# EAGLE design wireless-probe-v1 (EAGLE 6.4)
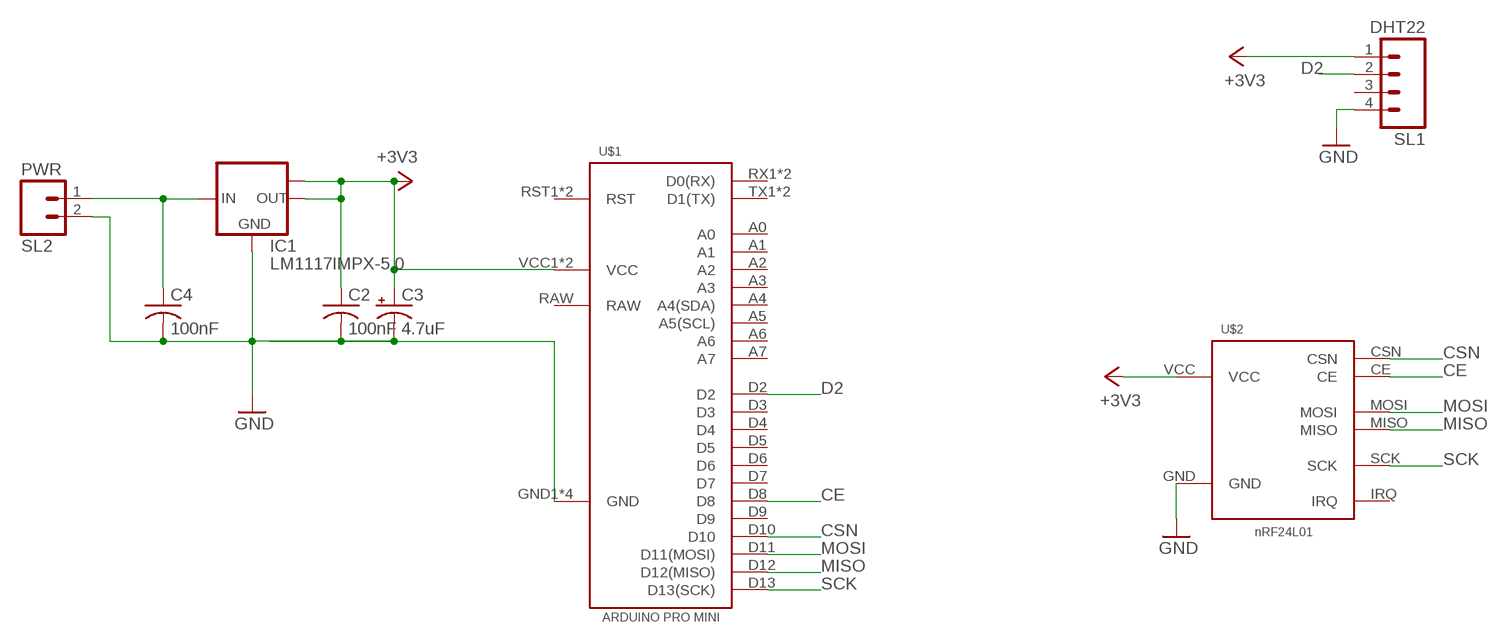
[diagram p0: schematic, sheet 1]

## Parts
C2  100nF  C-USC0603K  [C0603K]
C3  4.7uF  CPOL-USE1.8-4  [E1,8-4]
C4  100nF  C-USC0603K  [C0603K]
IC1  LM1117IMPX-5.0  [SOT223]
SL1  DHT22  M04  [04P]
SL2  PWR  M02  [02P]
U$1  ARDUINO-PRO-MINI  [ARDUINO-PRO-MINI]
U$2  NRF24L01MODULE  [NRF24L01-MODULE]

## Nets
+3V3: C2.1 C3.+ IC1.2(OUT) IC1.TAB(OUT1) SL1.1 U$1.VCC1(VCC) U$1.VCC2(VCC) U$2.VCC
+12V: C4.1 IC1.3(IN) SL2.1
CE: U$1.D8 U$2.CE
CSN: U$1.D10 U$2.CSN
D2: SL1.2 U$1.D2
GND: C2.2 C3.- C4.2 IC1.1(GND) SL1.4 SL2.2 U$1.GND1(GND) U$1.GND2(GND) U$1.GND3(GND) U$1.GND4(GND) U$2.GND
MISO: U$1.D12(D12(MISO)) U$2.MISO
MOSI: U$1.D11(D11(MOSI)) U$2.MOSI
SCK: U$1.D13(D13(SCK)) U$2.SCK
Unconnected: SL1.3 U$1.A0 U$1.A1 U$1.A2 U$1.A3 U$1.A4(A4(SDA)) U$1.A5(A5(SCL)) U$1.A6 U$1.A7 U$1.D3 U$1.D4 U$1.D5 U$1.D6 U$1.D7 U$1.D9 U$1.RST1(RST) U$1.RST2(RST) U$1.RX1(D0(RX)) U$1.RX2(D0(RX)) U$1.TX1(D1(TX)) U$1.TX2(D1(TX)) U$2.IRQ

## Power pins joined to a net without a drawn wire
RAW: U$1.RAW

## Library data of the parts
C2 C4 = adafruit:C-US: CAPACITOR, American symbol
C3 = adafruit:CPOL-US: POLARIZED CAPACITOR, American symbol
IC1 = lm1117:LM1117IMPX-*
SL1 = con-amp-quick:M04: AMP QUICK CONNECTOR; OC_FARNELL: unknown; OC_NEWARK: unknown
SL2 = con-amp-quick:M02: AMP QUICK CONNECTOR; OC_FARNELL: unknown; OC_NEWARK: unknown
U$1 = serge:ARDUINO-PRO-MINI
U$2 = serge:NRF24L01

## Board
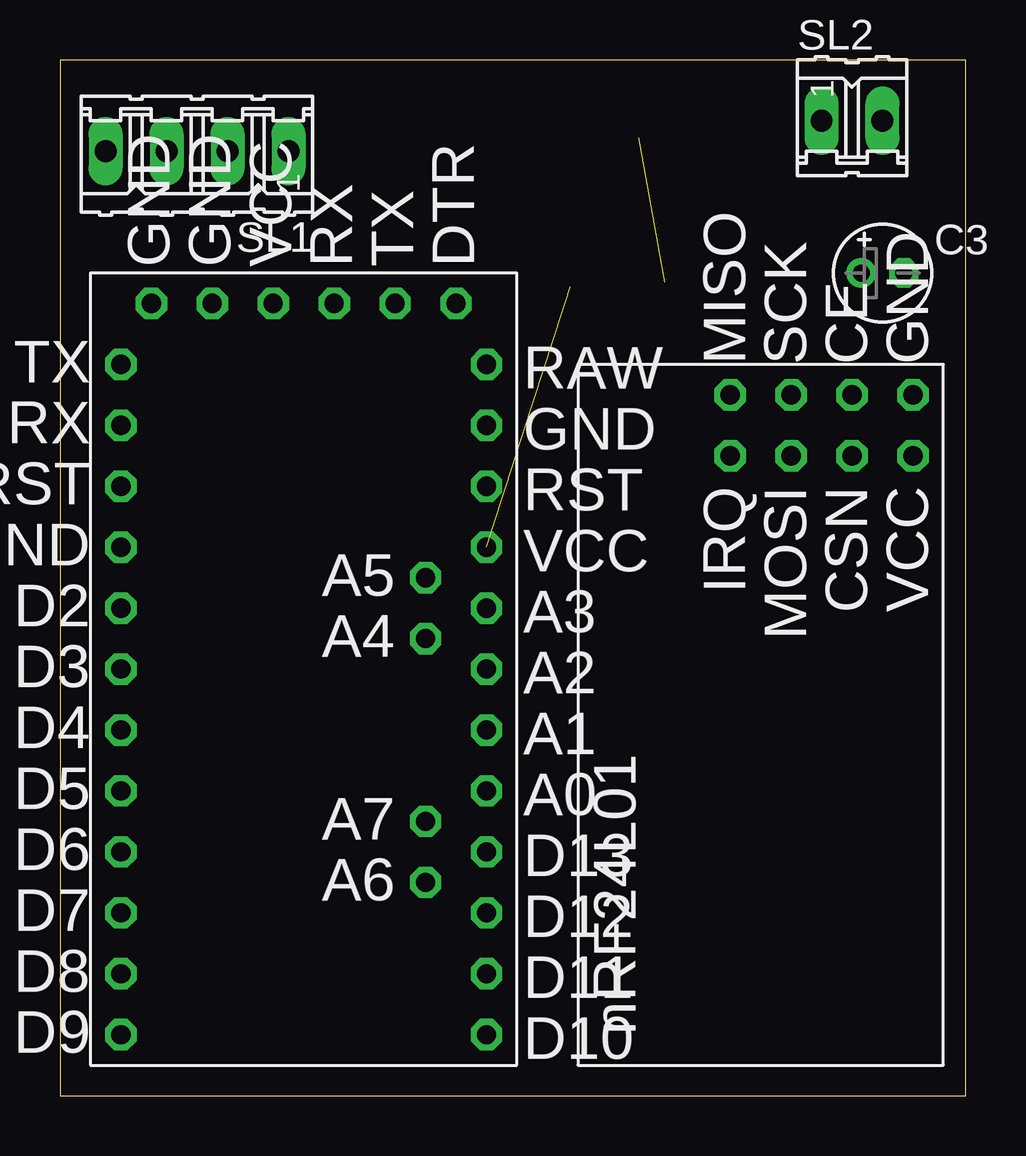
[diagram p1: board, top side]
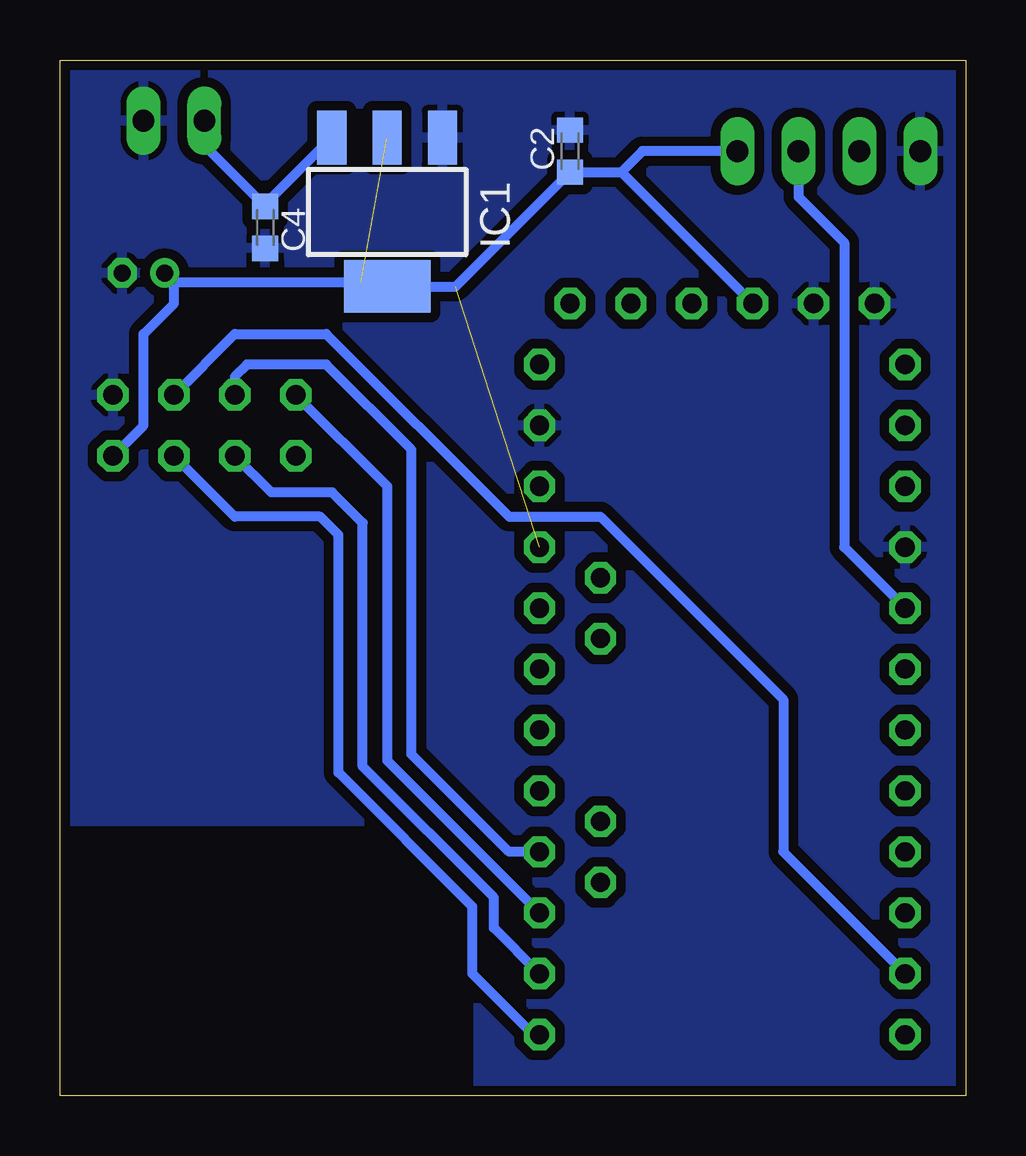
[diagram p2: board, bottom side, seen from below]

Size 37.77 x 43.17 mm. Coordinates in mm from the lower left corner, seen from the top.
Outline: 0,0 37.77,0 37.77,43.17 0,43.17 0,0
Copper layers (1*16): Top 0.035mm / dielectric 1.5mm / Bottom 0.035mm
Design rules "default": minimum track width 10mil, minimum drill 24mil, track to track 16mil, track to pad 16mil, pad to pad 16mil, via to via 16mil, smd to smd 16mil, copper to edge 16mil, drill to drill 8mil, minimum pad ring 10mil, minimum via ring 8mil, stop-mask expansion 4mil, vias tented up to drill 0mil, thermal gap 10mil

### Footprints (pad centres in the part's own frame; a part is rotated, then mirrored left to right if it is on the bottom)
C0603K = smd 1.05 x 1.08: 1 -0.875,0; 2 0.875,0
E1,8-4 = drill 0.711 pad 1.168: + -0.889,0 | drill 0.711 pad 1.168 octagon: - 0.889,0
SOT223 = smd 1.219 x 2.235: 1 -2.311,-3.099; 2 0,-3.099; 3 2.311,-3.099 | smd 3.6 x 2.2: TAB 0,3.099
04P = drill 0.914 long: 1 -3.81,0; 2 -1.27,0; 3 1.27,0; 4 3.81,0
02P = drill 0.914 long: 1 -1.27,0; 2 1.27,0
ARDUINO-PRO-MINI = drill 0.8 octagon: A0 -3.81,-7.62; A1 -1.27,-7.62; A2 1.27,-7.62; A3 3.81,-7.62; A4 2.54,-5.08; A5 5.08,-5.08; A6 -7.62,-5.08; A7 -5.08,-5.08; D2 3.81,7.62; D3 1.27,7.62; D4 -1.27,7.62; D5 -3.81,7.62; D6 -6.35,7.62; D7 -8.89,7.62; D8 -11.43,7.62; D9 -13.97,7.62; D10 -13.97,-7.62; D11 -11.43,-7.62; D12 -8.89,-7.62; D13 -6.35,-7.62; DTR 16.51,-6.35; GND1 11.43,-7.62; GND2 16.51,6.35; GND3 16.51,3.81; GND4 6.35,7.62; RAW 13.97,-7.62; RST1 8.89,7.62; RST2 8.89,-7.62; RX1 11.43,7.62; RX2 16.51,-1.27; TX1 13.97,7.62; TX2 16.51,-3.81; VCC1 16.51,1.27; VCC2 6.35,-7.62
NRF24L01-MODULE = drill 0.8 octagon: CE 10.16,-2.54; CSN 7.62,-2.54; GND 10.16,-5.08; IRQ 7.62,2.54; MISO 10.16,2.54; MOSI 7.62,0; SCK 10.16,0; VCC 7.62,-5.08

### Placement (x,y rotation side)
C2  16.51,39.37 90 bottom
C3  34.29,34.29 0 top
C4  29.21,36.2 270 bottom
IC1  24.13,36.83 180 bottom
SL1  5.71,39.37 180 top
SL2  33.02,40.64 0 top
U$1  10.16,16.51 90 top
U$2  30.48,19.05 90 top

### Tracks (layer width: path | path; a pad name or v marks a point on that pad's centre or on a via)
+3V3  (2 unrouted)
  Bottom 0.406: U$2.VCC 34.29,27.94 34.29,31.75 33.02,33.02 33.02,33.91 | 33.02,33.91 C3.+ | 33.02,33.91 25.22,33.91 IC1.TAB 21.27,33.73 C2.1 14.37,38.49 | 14.37,38.49 U$1.VCC1 | SL1.1 13.49,39.37 14.37,38.49
+12V
  Bottom 0.406: SL2.1 31.75,39.61 C4.1 29.21,37.16 IC1.3
CE
  Bottom 0.406: U$2.CE 30.48,31.75 26.67,31.75 19.05,24.13 15.24,24.13 7.62,16.51 7.62,10.16 U$1.D8
CSN
  Bottom 0.406: U$1.D10 18.03,2.54 20.57,5.08 20.57,7.87 26.16,13.46 26.16,23.37 26.92,24.13 30.48,24.13 U$2.CSN
D2
  Bottom 0.406: SL1.2 6.99,37.47 5.08,35.56 5.08,22.86 U$1.D2
GND
  pour Bottom: 0,43.18 0,0 20.32,0 20.32,11.43 38.1,11.43 38.1,43.18
MISO
  Bottom 0.406: U$2.MISO 24.13,25.4 24.13,13.97 U$1.D12
MOSI
  Bottom 0.406: U$1.D11 19.68,6.99 19.68,8.26 25.15,13.72 25.15,23.88 26.42,25.15 28.96,25.15 U$2.MOSI
SCK
  Bottom 0.406: U$1.D13 19.05,10.16 23.11,14.22 23.11,26.92 26.67,30.48 29.97,30.48 30.48,29.97 U$2.SCK